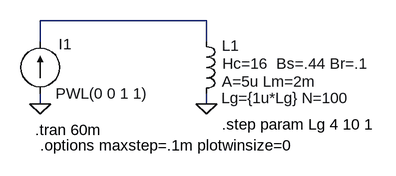
[diagram p0: schematic StepGap.asc]
StepGap.asc, the LTspice schematic file:
Version 4
SHEET 1 1024 680
WIRE 16 176 16 144
WIRE 16 272 16 256
WIRE 272 144 16 144
WIRE 272 176 272 144
WIRE 272 272 272 256
FLAG 272 272 0
FLAG 16 272 0
SYMBOL ind 256 160 R0
WINDOW 123 40 78 Left 0
WINDOW 39 39 103 Left 0
WINDOW 40 39 160 Left 0
WINDOW 0 40 22 Left 0
WINDOW 3 41 50 Left 0
SYMATTR Value2 A=5u Lm=2m
SYMATTR SpiceLine Lg={1u*Lg} N=100
SYMATTR InstName L1
SYMATTR Value Hc=16  Bs=.44 Br=.1
SYMBOL current 16 256 M180
WINDOW 0 28 76 Left 0
WINDOW 3 24 0 Left 0
SYMATTR InstName I1
SYMATTR Value PWL(0 0 1 1)
TEXT 8 312 Left 0 !.tran 60m
TEXT 296 304 Left 0 !.step param Lg 4 10 1
TEXT 16 336 Left 0 !.options maxstep=.1m plotwinsize=0

The netlist it stands for:
* StepGap.asc
L1 N001 0 Hc=16  Bs=.44 Br=.1 A=5u Lm=2m Lg={1u*Lg} N=100
I1 0 N001 PWL(0 0 1 1)
.tran 60m
.step param Lg 4 10 1
.options maxstep=.1m plotwinsize=0
.backanno
.end